# EAGLE design clock2x (EAGLE 6.3)
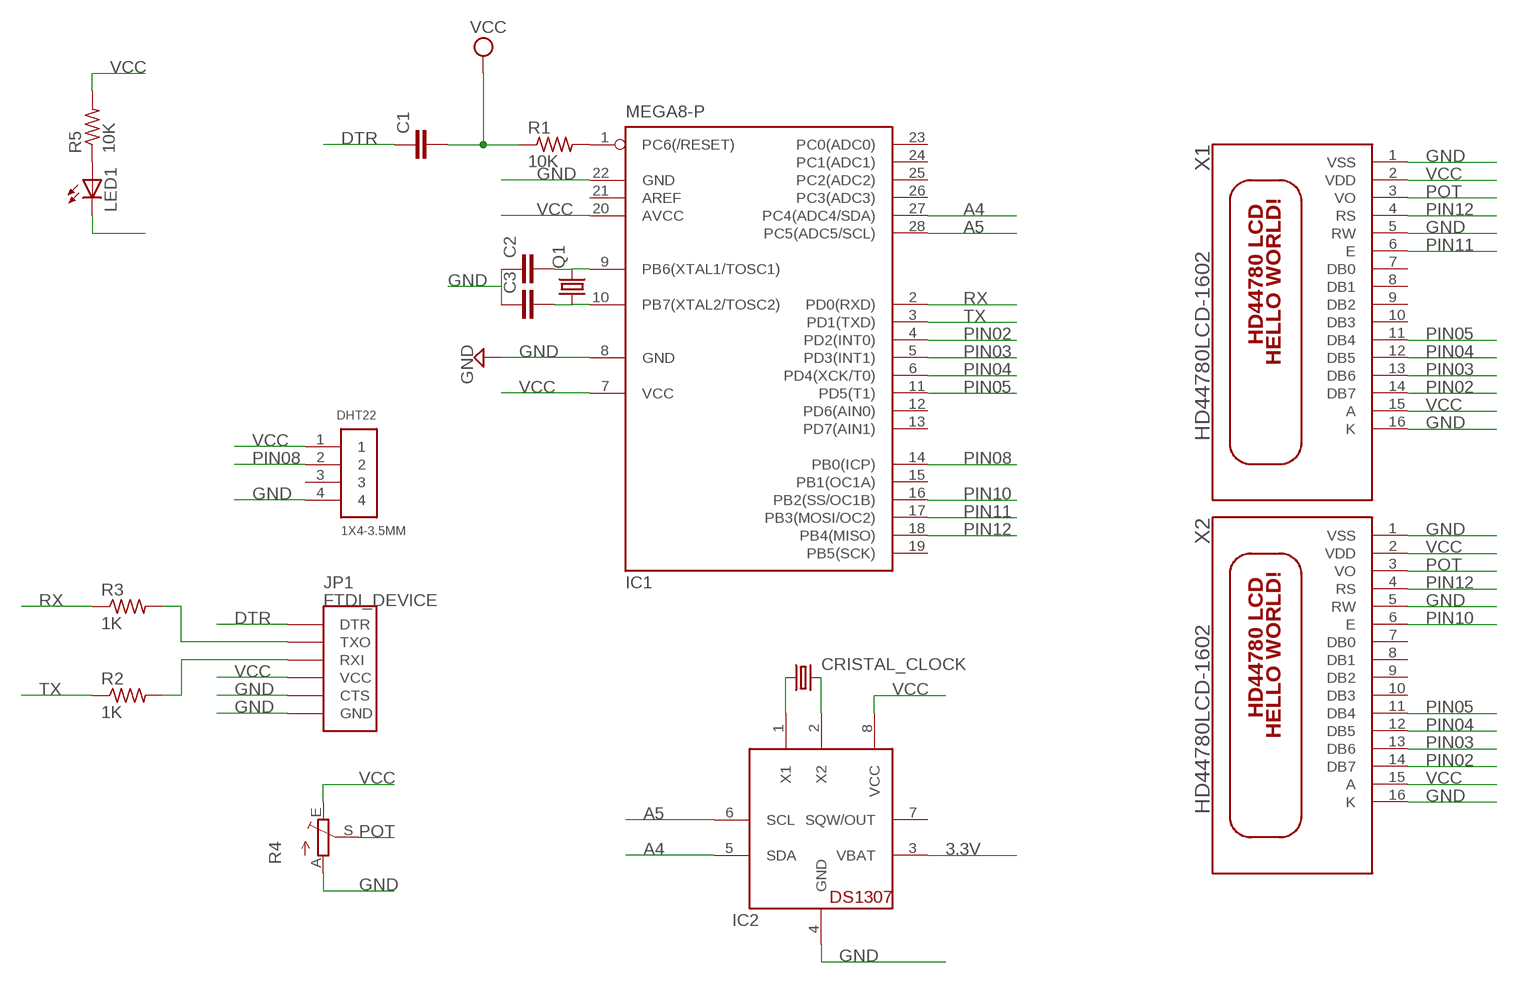
[diagram p0: schematic, sheet 1]

## Parts
C1  C5/2.5  [C5B2.5]
C2  C5/2.5  [C5B2.5]
C3  C5/2.5  [C5B2.5]
CRISTAL_CLOCK  CRYSTALTC26V  [TC26V]
DHT22  1X4-3.5MM  [1X04-3.5MM]
IC1  MEGA8-P  [DIL28-3]
IC2  DS1307  [DIL08]
JP1  FTDI_DEVICE  [FTDI_DEVICE_SIDE]
LED1  LED5MM  [LED5MM]
Q1  CRYSTALHC49S  [HC49/S]
R1  10K  R-US_0207/12  [0207/12]
R2  1K  R-US_0207/12  [0207/12]
R3  1K  R-US_0207/12  [0207/12]
R4  TRIM_EU-RJ9W  [RJ9W]
R5  10K  R-US_0207/12  [0207/12]
X1  HD44780LCD-1602  [LCD1602]
X2  HD44780LCD-1602  [LCD1602]

## Nets
3.3V: IC2.3(VBAT)
A4: IC1.27(PC4(ADC4/SDA)) IC2.5(SDA)
A5: IC1.28(PC5(ADC5/SCL)) IC2.6(SCL)
DTR: C1.1 JP1.P$1(DTR)
GND: C2.1 C3.1 DHT22.4 IC1.8(GND) IC1.22(GND) IC2.4(GND) JP1.P$5(CTS) JP1.P$6(GND) LED1.K(C) R4.A X1.1(VSS) X1.5(RW) X1.16(K) X2.1(VSS) X2.5(RW) X2.16(K)
N$1: IC1.1(PC6(/RESET)) R1.2
N$2: C2.2 IC1.9(PB6(XTAL1/TOSC1)) Q1.2
N$3: C3.2 IC1.10(PB7(XTAL2/TOSC2)) Q1.1
N$4: JP1.P$2(TXO) R3.2
N$5: JP1.P$3(RXI) R2.2
N$6: LED1.A R5.1
N$17: CRISTAL_CLOCK.1 IC2.1(X1)
N$18: CRISTAL_CLOCK.2 IC2.2(X2)
PIN02: IC1.4(PD2(INT0)) X1.14(DB7) X2.14(DB7)
PIN03: IC1.5(PD3(INT1)) X1.13(DB6) X2.13(DB6)
PIN04: IC1.6(PD4(XCK/T0)) X1.12(DB5) X2.12(DB5)
PIN05: IC1.11(PD5(T1)) X1.11(DB4) X2.11(DB4)
PIN08: DHT22.2 IC1.14(PB0(ICP))
PIN10: IC1.16(PB2(SS/OC1B)) X2.6(E)
PIN11: IC1.17(PB3(MOSI/OC2)) X1.6(E)
PIN12: IC1.18(PB4(MISO)) X1.4(RS) X2.4(RS)
POT: R4.S X1.3(VO) X2.3(VO)
RX: IC1.2(PD0(RXD)) R3.1
TX: IC1.3(PD1(TXD)) R2.1
VCC: C1.2 DHT22.1 IC1.7(VCC) IC1.20(AVCC) IC2.8(VCC) JP1.P$4(VCC) R1.1 R4.E R5.2 X1.2(VDD) X1.15(A) X2.2(VDD) X2.15(A)
Unconnected: DHT22.3 IC1.12(PD6(AIN0)) IC1.13(PD7(AIN1)) IC1.15(PB1(OC1A)) IC1.19(PB5(SCK)) IC1.21(AREF) IC1.23(PC0(ADC0)) IC1.24(PC1(ADC1)) IC1.25(PC2(ADC2)) IC1.26(PC3(ADC3)) IC2.7(SQW/OUT) X1.7(DB0) X1.8(DB1) X1.9(DB2) X1.10(DB3) X2.7(DB0) X2.8(DB1) X2.9(DB2) X2.10(DB3)

## Library data of the parts
C1-C3 = capacitor-wima:C: CAPACITOR naming: grid - package width
CRISTAL_CLOCK = adafruit:CRYSTAL: CRYSTAL; OC_FARNELL: unknown; OC_NEWARK: unknown
DHT22 = adafruit:1X4: 4-pin connector
IC1 = atmel:MEGA8-P: MICROCONTROLLER 8 Kbytes FLASH, 1 kbytes SRAM, 512 bytes EEPROM, USART, 4-channel 10 bit ADC, 2-channel 8 bit ADC Pin compatible with Atmega48, ATMega88, ATMega168 Source: avr.lbr; OC_FARNELL: unknown; OC_NEWARK: unknown
IC2 = adafruit:DS1307: DS1307 Real time clock (RTC) with battery backup ability. Talk to it via i2c
JP1 = SparkFun-Connectors:FTDI_DEVICE: Connector which mates to FTDI basic or FTDI cable.
LED1 = adafruit:LED: LED OSRAM: - CHIPLED LG R971, LG N971, LY N971, LG Q971, LY Q971, LO R971, LY R971 LH N974, LH R974 LS Q976, LO Q976, LY Q976 LO Q996 - Hyper CHIPLED LW Q18S LB Q993, LB Q99A, LB R99A - SideLED LS A670, LO A670, LY A670, LG A670, LP A670 LB A673, LV A673, LT A673, LW A673 LH A674 LY A675 LS A676, LA A676, LO A676, LY A676, LW A676 LS A679, LY A679, LG A679 - Hyper Micro SIDELED® LS Y876, LA Y876, LO Y876, LY Y876 LT Y87S - SmartLED LW L88C, LW L88S LB L89C, LB L89S, LG L890 LS L89K, LO L89K, LY L89K LS L896, LA L896, LO L896, LY L896 - TOPLED LS T670, LO T670, LY T670, LG T670, LP T670 LSG T670, LSP T670, LSY T670, LOP T670, LYG T670 LG T671, LOG T671, LSG T671 LB T673, LV T673, LT T673, LW T673 LH T674 LS T676, LA T676, LO T676, LY T676, LB T676, LH T676, LSB T676, LW T676 LB T67C, LV T67C, LT T67C, LS T67K, LO T67K, LY T67K, LW E67C LS E67B, LA E67B, LO E67B, LY E67B, LB E67C, LV E67C, LT E67C LW T67C LS T679, LY T679, LG T679 LS T770, LO T770, LY T770, LG T770, LP T770 LB T773, LV T773, LT T773, LW T773 LH T774 LS E675, LA E675, LY E675, LS T675 LS T776, LA T776, LO T776, LY T776, LB T776 LHGB T686 LT T68C, LB T68C - Hyper Mini TOPLED® LB M676 - Mini TOPLED Santana® LG M470 LS M47K, LO M47K, LY M47K Source: http://www.osram.convergy.de/
Q1 = adafruit:CRYSTAL: CRYSTAL; OC_FARNELL: 1667008; OC_NEWARK: unknown
R1-R3 R5 = adafruit:R-US_: RESISTOR, American symbol
R4 = pot:TRIM_EU-: POTENTIOMETER
X1 X2 = adafruit:HD44780LCD: HD44780 LCD Standard character type LCDs, available in sizes from 8x1 to 40x4!

## Board
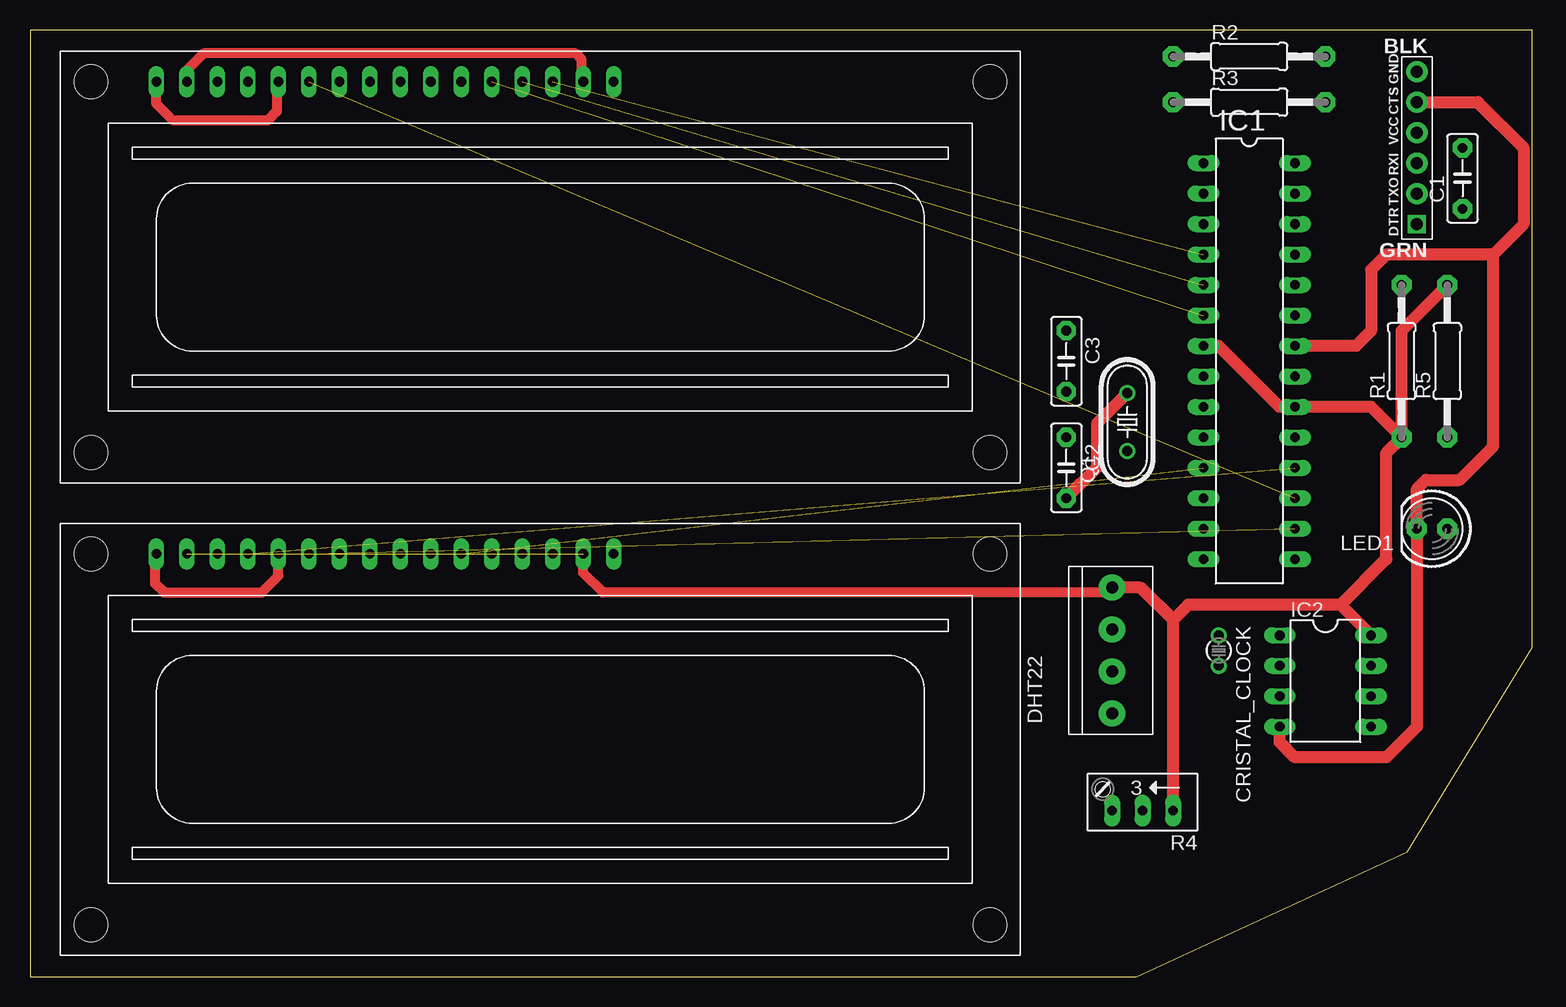
[diagram p1: board, top side]
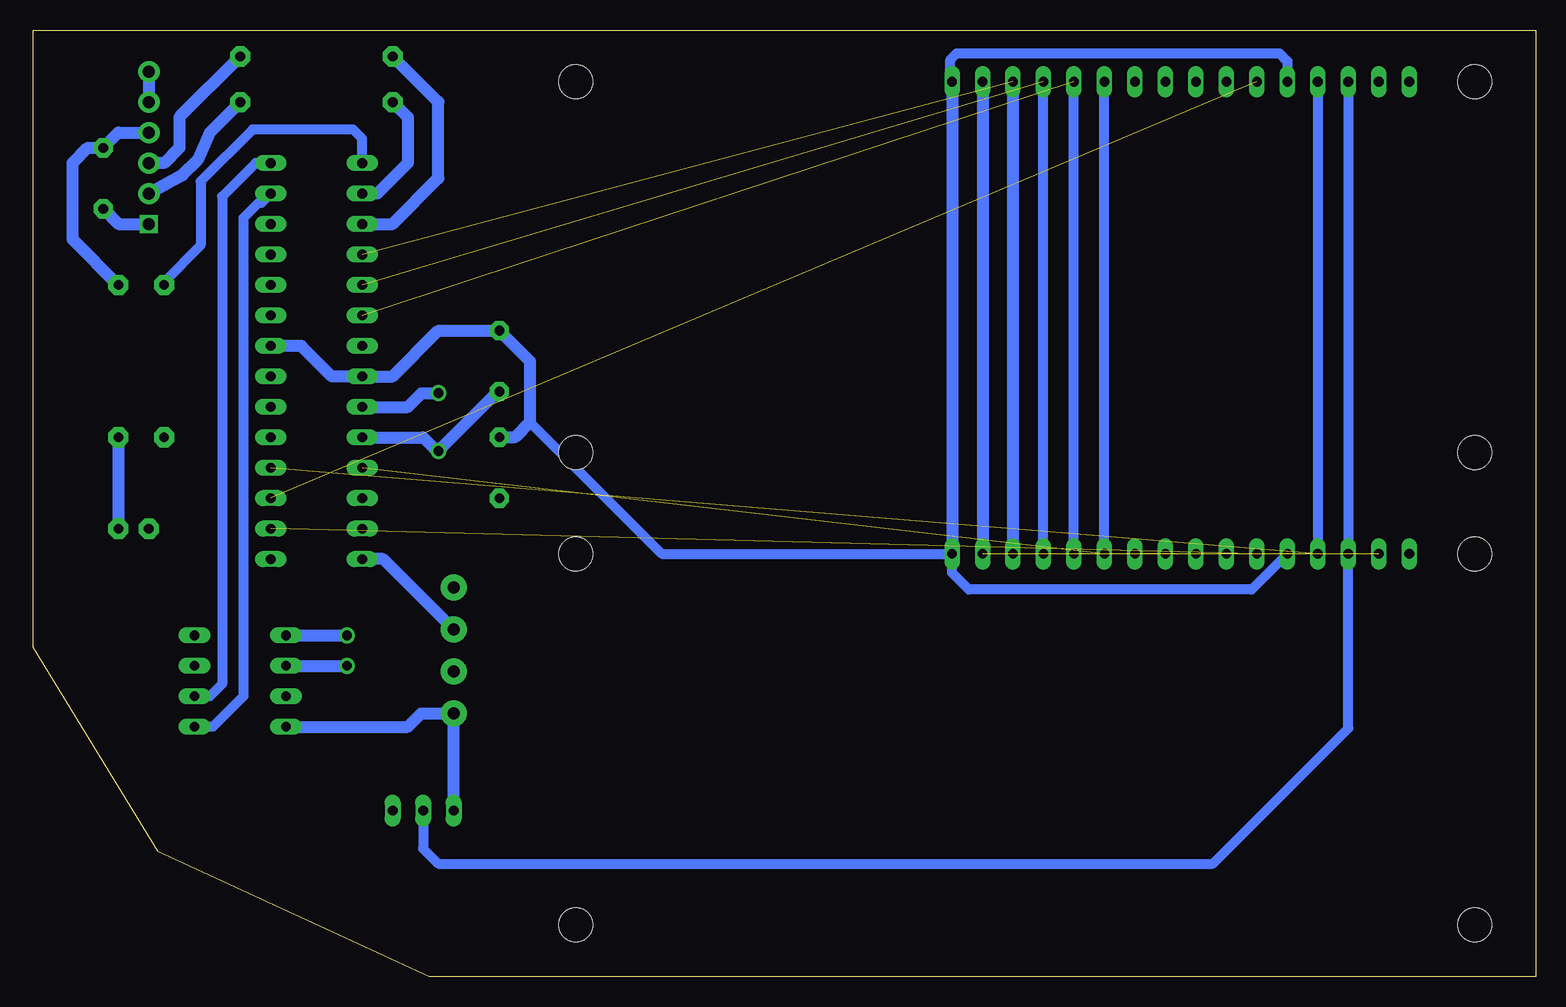
[diagram p2: board, bottom side, seen from below]

Size 125.2 x 78.92 mm. Coordinates in mm from the lower left corner, seen from the top.
Outline: 0,0 92.2,0 114.79,10.41 125.2,27.43 125.2,78.92 0,78.92 0,0
Copper layers (1*16): Top 0.035mm / dielectric 1.5mm / Bottom 0.035mm
Design rules "default": minimum track width 10mil, minimum drill 24mil, track to track 8mil, track to pad 8mil, pad to pad 8mil, via to via 8mil, smd to smd 8mil, copper to edge 40mil, drill to drill 8mil, minimum pad ring 10mil, minimum via ring 8mil, stop-mask expansion 4mil, vias tented up to drill 0mil, thermal gap 10mil

### Footprints (pad centres in the part's own frame; a part is rotated, then mirrored left to right if it is on the bottom)
C5B2.5 = drill 0.813 pad 1.6 octagon: 1 -2.54,0; 2 2.54,0
TC26V = drill 0.813: 1 -1.27,0; 2 1.27,0
1X04-3.5MM = drill 1 pad 2.184: 1 -5.25,0; 2 -1.75,0; 3 1.75,0; 4 5.25,0
DIL28-3 = drill 0.813 long: 1 -16.51,-3.81; 2 -13.97,-3.81; 3 -11.43,-3.81; 4 -8.89,-3.81; 5 -6.35,-3.81; 6 -3.81,-3.81; 7 -1.27,-3.81; 8 1.27,-3.81; 9 3.81,-3.81; 10 6.35,-3.81; 11 8.89,-3.81; 12 11.43,-3.81; 13 13.97,-3.81; 14 16.51,-3.81; 15 16.51,3.81; 16 13.97,3.81; 17 11.43,3.81; 18 8.89,3.81; 19 6.35,3.81; 20 3.81,3.81; 21 1.27,3.81; 22 -1.27,3.81; 23 -3.81,3.81; 24 -6.35,3.81; 25 -8.89,3.81; 26 -11.43,3.81; 27 -13.97,3.81; 28 -16.51,3.81
DIL08 = drill 0.813 long: 1 -3.81,-3.81; 2 -1.27,-3.81; 3 1.27,-3.81; 4 3.81,-3.81; 5 3.81,3.81; 6 1.27,3.81; 7 -1.27,3.81; 8 -3.81,3.81
FTDI_DEVICE_SIDE = drill 1 square: P$1 -6.35,0 | drill 1.016 pad 1.778: P$2 -3.81,0; P$3 -1.27,0; P$4 1.27,0; P$5 3.81,0; P$6 6.35,0
LED5MM = drill 0.813 pad 1.676 octagon: A -1.27,0; K 1.27,0
HC49/S = drill 0.813: 1 -2.413,0; 2 2.413,0
0207/12 = drill 0.813 pad 1.676 octagon: 1 -6.35,0; 2 6.35,0
RJ9W = drill 0.813 long: A 2.54,0.635; E -2.54,0.635; S 0,0.635
LCD1602 = drill 0.8 long: 1 8,33.46; 2 10.54,33.46; 3 13.08,33.46; 4 15.62,33.46; 5 18.16,33.46; 6 20.7,33.46; 7 23.24,33.46; 8 25.78,33.46; 9 28.32,33.46; 10 30.86,33.46; 11 33.4,33.46; 12 35.94,33.46; 13 38.48,33.46; 14 41.02,33.46; 15 43.56,33.46; 16 46.1,33.46 | hole 2.8: 2.54,2.54; 2.54,33.46; 77.46,33.46; 77.46,2.54

### Placement (x,y rotation side)
C1  119.38,66.55 90 top
C2  86.36,42.42 270 top
C3  86.36,51.31 270 top
CRISTAL_CLOCK  99.06,27.18 270 top
DHT22  90.17,27.18 270 top
IC1  101.6,51.31 270 top
IC2  107.95,24.64 270 top
JP1  115.57,69.09 90 top
LED1  116.84,37.34 180 top
Q1  91.44,46.23 90 top
R1  114.3,51.31 90 top
R2  101.6,76.71 0 top
R3  101.6,72.9 0 top
R4  92.71,14.48 180 top
R5  118.11,51.31 90 top
X1  2.54,41.15 0 top
X2  2.54,1.78 0 top

### Tracks (layer width: path | path; a pad name or v marks a point on that pad's centre or on a via)
A4
  Bottom 0.813: IC1.27 106.17,64.52 106.43,64.52 107.7,63.25 107.7,23.37 110.24,20.83 IC2.5
A5
  Bottom 0.813: IC1.28 106.68,67.82 109.47,65.02 109.47,24.38 110.49,23.37 IC2.6
DTR
  Bottom 1.016: C1.1 118.11,62.74 JP1.P$1
GND
  Top 0.813: X2.1 10.41,35.11 10.41,32.77 11.18,32 19.3,32 20.7,33.4 X2.5 | X1.5 20.57,74.48 20.57,72.14 19.81,71.37 11.94,71.37 10.54,72.77 X1.1
  Top 1.016: IC2.4 104.14,19.56 105.41,18.29 113.03,18.29 115.57,20.83 LED1.K 115.57,40.64 116.33,41.4 119.13,41.4 121.92,44.2 121.92,60.2 | JP1.P$5 120.65,72.9 124.46,69.09 124.46,62.74 121.92,60.2 | 121.92,60.2 113.03,60.2 111.76,58.93 111.76,53.85 110.49,52.58 IC1.22
  Bottom 0.813: X1.16 48.77,74.74 48.77,76.45 48.26,76.96 21.34,76.96 20.7,76.33 X1.5 | 83.82,46.23 72.83,35.24 X2.16 48.64,33.65 47.24,32.26 23.68,32.26 X2.5
  Bottom 1.016: C2.1 85.09,44.96 83.82,46.23 83.82,51.31 C3.1 91.44,53.85 95.25,50.04 IC1.8 100.33,50.04 102.87,52.58 IC1.22 | JP1.P$6 JP1.P$5 | IC2.4 93.98,20.83 92.88,21.93 DHT22.4 R4.A | X1.16 X2.16
N$1
  Bottom 0.813: IC1.1 97.79,69.85 98.55,70.61 106.93,70.61 111.25,66.29 111.25,60.96 114.3,57.91 R1.2
N$2
  Top 1.016: Q1.2 88.9,46.1 88.9,42.42 C2.2
  Bottom 1.016: IC1.9 93.98,47.5 92.84,48.64 Q1.2
N$3
  Bottom 1.016: IC1.10 92.71,44.96 91.57,43.82 Q1.1 86.49,48.77 C3.2
N$4
  Bottom 1.016: R3.2 110.49,70.36 111.51,68.07 112.78,66.8 JP1.P$2
N$5
  Bottom 1.016: R2.2 113.03,71.63 113.03,69.09 114.3,67.82 JP1.P$3
N$6
  Bottom 1.016: R5.1 LED1.A
N$17
  Bottom 1.016: IC2.1 CRISTAL_CLOCK.1
N$18
  Bottom 1.016: IC2.2 CRISTAL_CLOCK.2
PIN02  (1 unrouted)
  Bottom 1.016: X1.14 X2.14
PIN03  (1 unrouted)
  Bottom 0.813: X2.13 X1.13
PIN04  (1 unrouted)
  Bottom 0.813: X2.12 X1.12
PIN05  (1 unrouted)
  Bottom 0.813: X2.11 X1.11
PIN08
  Bottom 1.016: DHT22.2 96.04,34.8 IC1.14
PIN10  (1 unrouted)
PIN11  (1 unrouted)
PIN12  (1 unrouted)
  Bottom 0.813: X1.4 X2.4
POT
  Bottom 0.813: X1.3 X2.3 15.62,20.7 26.92,9.4 91.44,9.4 92.71,10.67 R4.S
RX
  Bottom 1.016: R3.1 93.98,71.63 93.98,67.82 96.52,65.28 IC1.2
TX
  Bottom 1.016: IC1.3 95.25,62.74 91.44,66.55 91.44,72.9 R2.1
VCC  (1 unrouted)
  Top 0.813: X1.15 45.97,74.73 45.97,76.45 45.47,76.96 14.48,76.96 13.08,75.56 X1.2 | DHT22.1 89.75,32 47.75,32 46.1,33.66 X2.15
  Top 1.016: R4.E 95.25,29.72 | 95.25,29.72 92.54,32.43 DHT22.1 | IC2.8 109.22,30.99 | 109.22,30.99 96.52,30.99 95.25,29.72 | 109.22,30.99 113.03,34.8 113.03,43.69 R1.1 | R1.1 114.3,53.85 R5.2 | R1.1 111.76,47.5 IC1.20 104.14,47.5 99.06,52.58 IC1.7
  Bottom 1.016: JP1.P$4 118.11,70.36 C1.2 120.65,69.09 121.92,67.82 121.92,61.47 R5.2 | X1.15 X2.15